# EAGLE design humidity and temprature sensor (EAGLE 6.1)
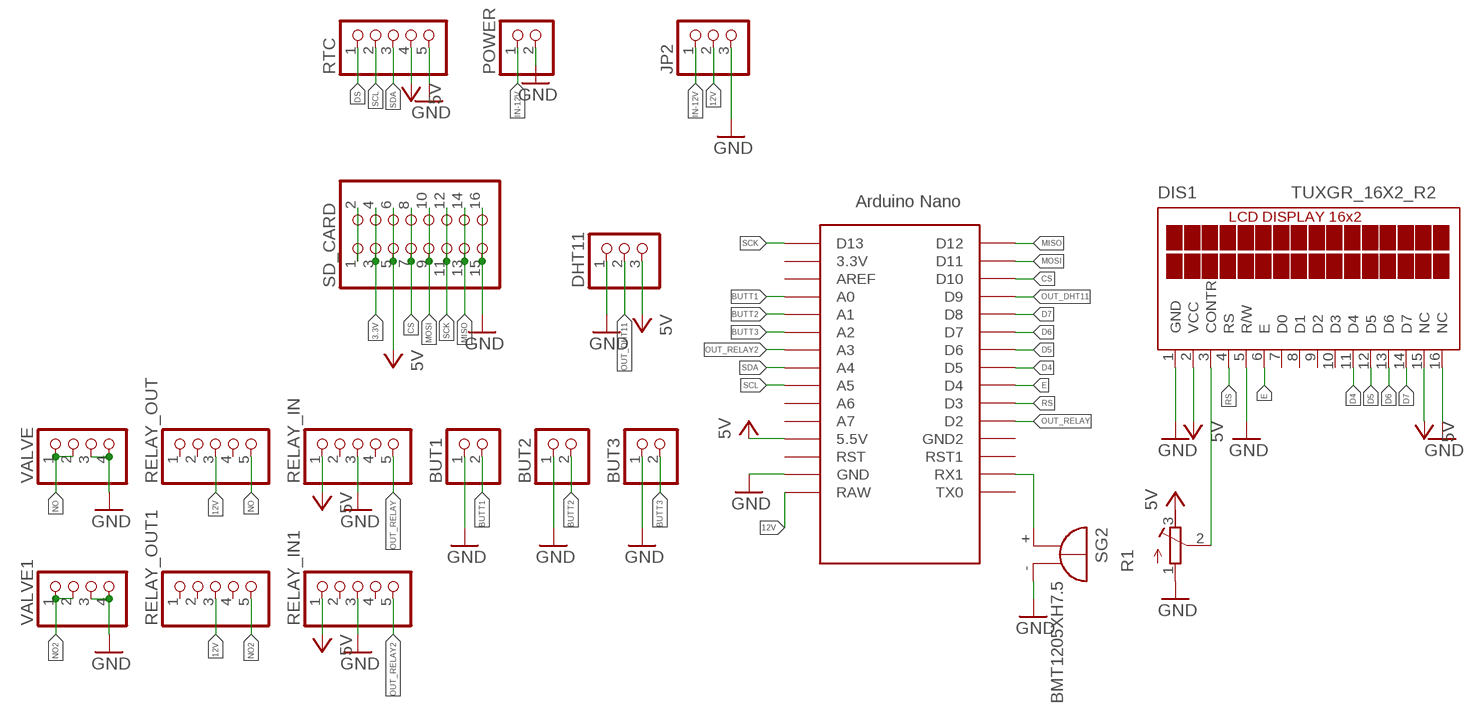
[diagram p0: schematic, sheet 1]

## Parts
BUT1  PINHD-1X2  [1X02]
BUT2  PINHD-1X2  [1X02]
BUT3  PINHD-1X2  [1X02]
DHT11  PINHD-1X3  [1X03]
DIS1  TUXGR_16X2_R2  [TUXGR_16X2_R2]
JP2  PINHD-1X3  [1X03]
POWER  PINHD-1X2  [1X02]
R1  R-TRIMM3339P  [RTRIM3339P]
RELAY_IN  PINHD-1X5  [1X05]
RELAY_IN1  PINHD-1X5  [1X05]
RELAY_OUT  PINHD-1X5  [1X05]
RELAY_OUT1  PINHD-1X5  [1X05]
RTC  PINHD-1X5  [1X05]
SD_CARD  PINHD-2X8  [2X08]
SG2  BMT1205XH7.5  [BMT1205XH7.5]
U$2  NANO  [NANO]
VALVE  PINHD-1X4  [1X04]
VALVE1  PINHD-1X4  [1X04]

## Nets
3.3V: SD_CARD.3 SD_CARD.4
12V: JP2.2 RELAY_OUT1.3 RELAY_OUT.3 U$2.RAW
BUTT1: BUT1.2 U$2.A0
BUTT2: BUT2.2 U$2.A1
BUTT3: BUT3.2 U$2.A2
CS: SD_CARD.7 SD_CARD.8 U$2.D10
D4: DIS1.11(D4) U$2.D5
D5: DIS1.12(D5) U$2.D6
D6: DIS1.13(D6) U$2.D7
D7: DIS1.14(D7) U$2.D8
DS: RTC.1
E: DIS1.6(E) U$2.D4
GND: BUT1.1 BUT2.1 BUT3.1 DHT11.1 DIS1.1(GND) DIS1.5(R/W) DIS1.16(NC) JP2.3 POWER.2 R1.1(E) RELAY_IN1.3 RELAY_IN.3 RTC.5 SD_CARD.15 SD_CARD.16 SG2.- U$2.GND VALVE1.3 VALVE1.4 VALVE.3 VALVE.4
IN-12V: JP2.1 POWER.1
MISO: SD_CARD.13 SD_CARD.14 U$2.D12
MOSI: SD_CARD.9 SD_CARD.10 U$2.D11
N$2: SD_CARD.1 SD_CARD.2
N$5: DIS1.3(CONTR) R1.2(S)
N$6: SG2.+ U$2.RX1
NO: RELAY_OUT.5 VALVE.1 VALVE.2
NO2: RELAY_OUT1.5 VALVE1.1 VALVE1.2
OUT_DHT11: DHT11.2 U$2.D9
OUT_RELAY: RELAY_IN.5 U$2.D2
OUT_RELAY2: RELAY_IN1.5 U$2.A3
RS: DIS1.4(RS) U$2.D3
SCK: SD_CARD.11 SD_CARD.12 U$2.D13
SCL: RTC.2 U$2.A5
SDA: RTC.3 U$2.A4
VCC: DHT11.3 DIS1.2(VCC) DIS1.15(NC) R1.3(A) RELAY_IN1.1 RELAY_IN.1 RTC.4 SD_CARD.5 SD_CARD.6 U$2.5V(5.5V) ; supply symbol labelled 5V
Unconnected: DIS1.7(D0) DIS1.8(D1) DIS1.9(D2) DIS1.10(D3) RELAY_IN1.2 RELAY_IN1.4 RELAY_IN.2 RELAY_IN.4 RELAY_OUT1.1 RELAY_OUT1.2 RELAY_OUT1.4 RELAY_OUT.1 RELAY_OUT.2 RELAY_OUT.4 U$2.3.3V U$2.A6 U$2.A7 U$2.AREF U$2.GND1(GND2) U$2.RST U$2.RST1 U$2.TX0

## Library data of the parts
BUT1-BUT3 POWER = pinhead:PINHD-1X2: PIN HEADER
DHT11 JP2 = pinhead:PINHD-1X3: PIN HEADER
DIS1 = display-lcd:TUXGR_16X2_R2: Tuxgraphics LCD display 16x2 characters reflective, without background light Source: tuxgr_12x2_r2.pdf; OC_FARNELL: unknown; OC_NEWARK: unknown
R1 = resistor:R-TRIMM: Trimm resistor
RELAY_IN RELAY_IN1 RELAY_OUT RELAY_OUT1 RTC = pinhead:PINHD-1X5: PIN HEADER
SD_CARD = pinhead:PINHD-2X8: PIN HEADER
SG2 = buzzer:BMT1205XH7.5: MAGNETIC TRANSDUCER Source: Http:www.be-star.com; OC_FARNELL: unknown; OC_NEWARK: unknown
U$2 = Arduino-clone:NANO: Arduino Nano
VALVE VALVE1 = pinhead:PINHD-1X4: PIN HEADER

## Board
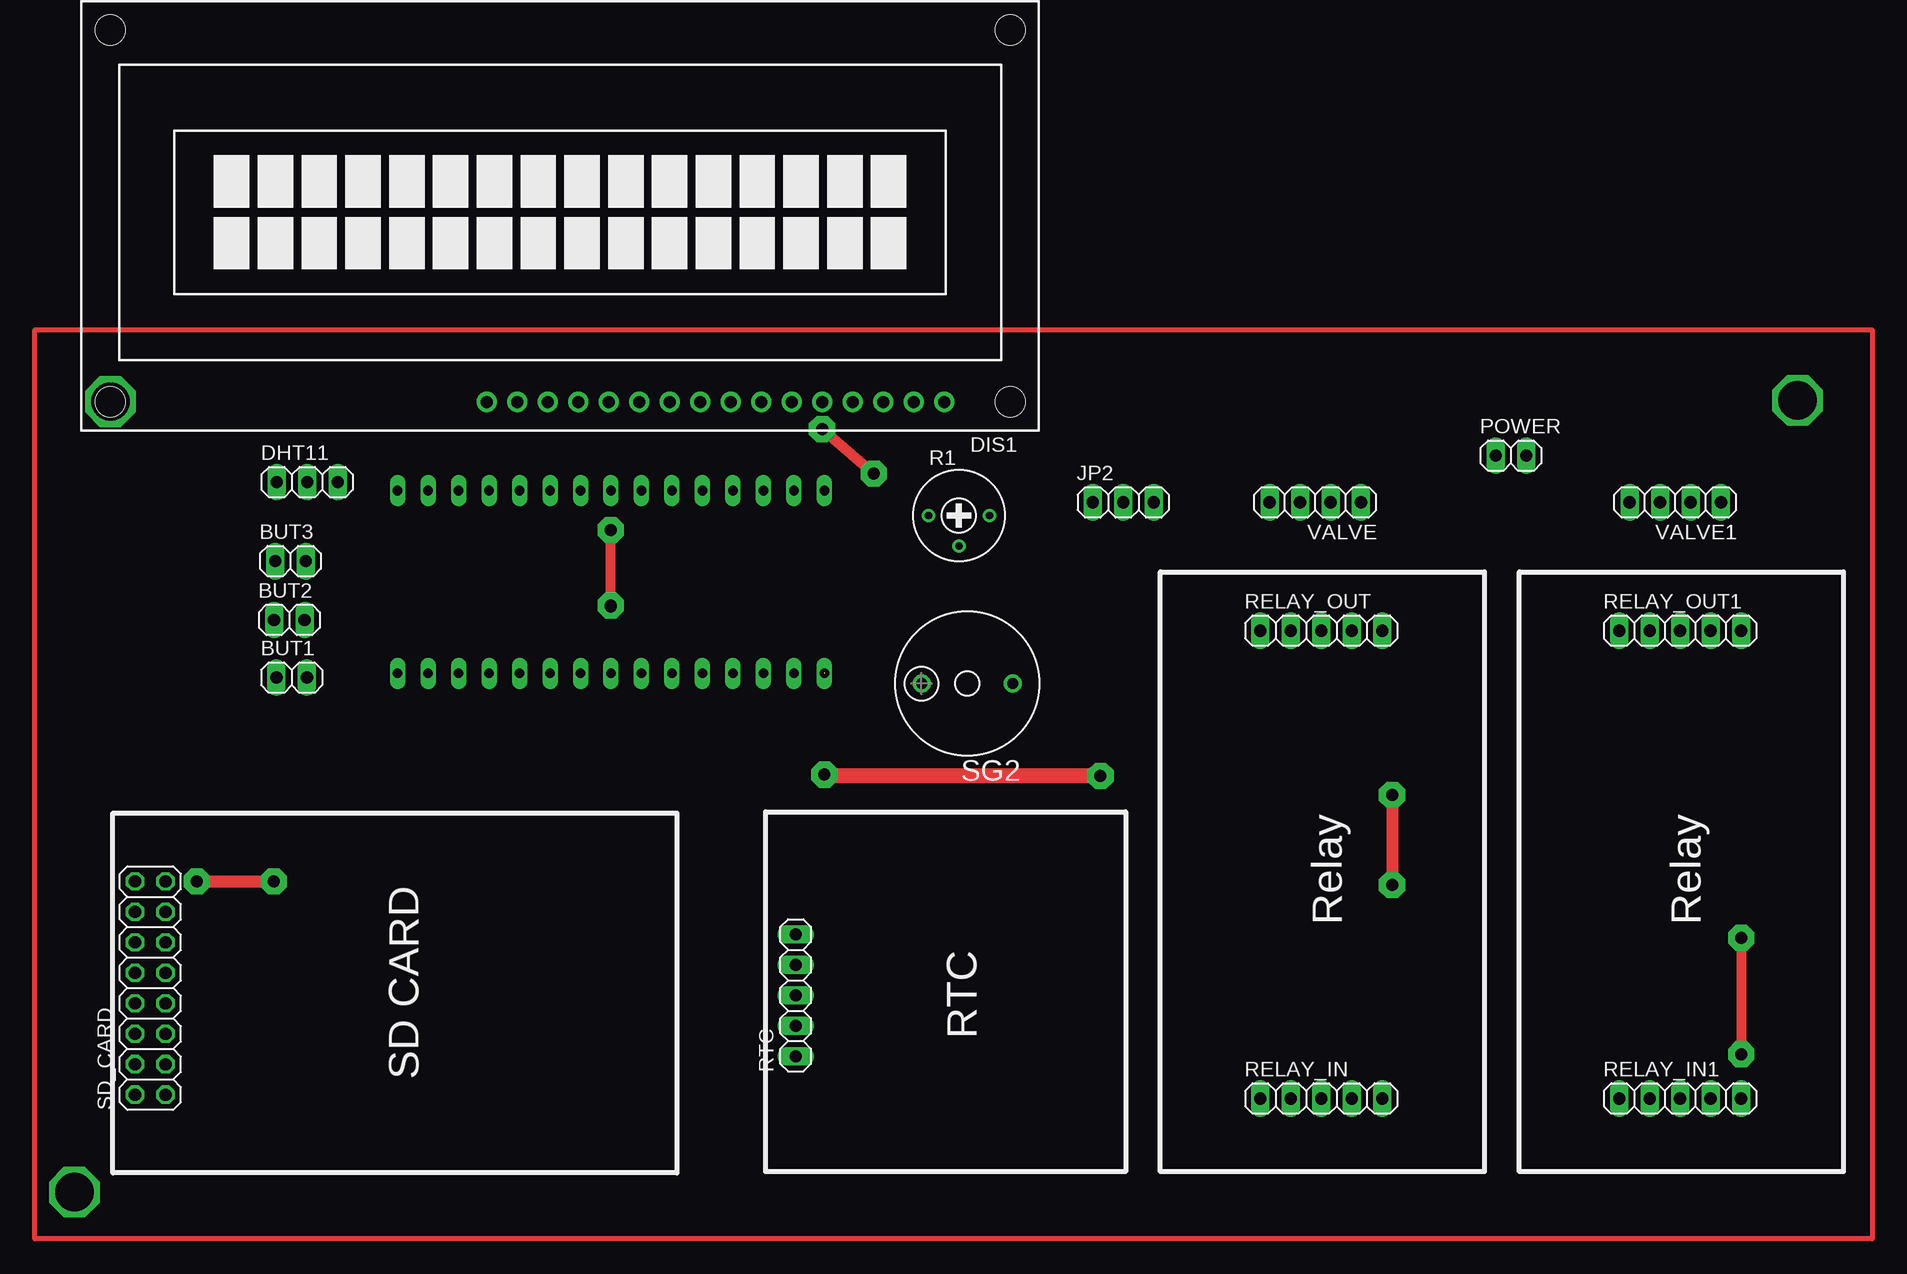
[diagram p1: board, top side]
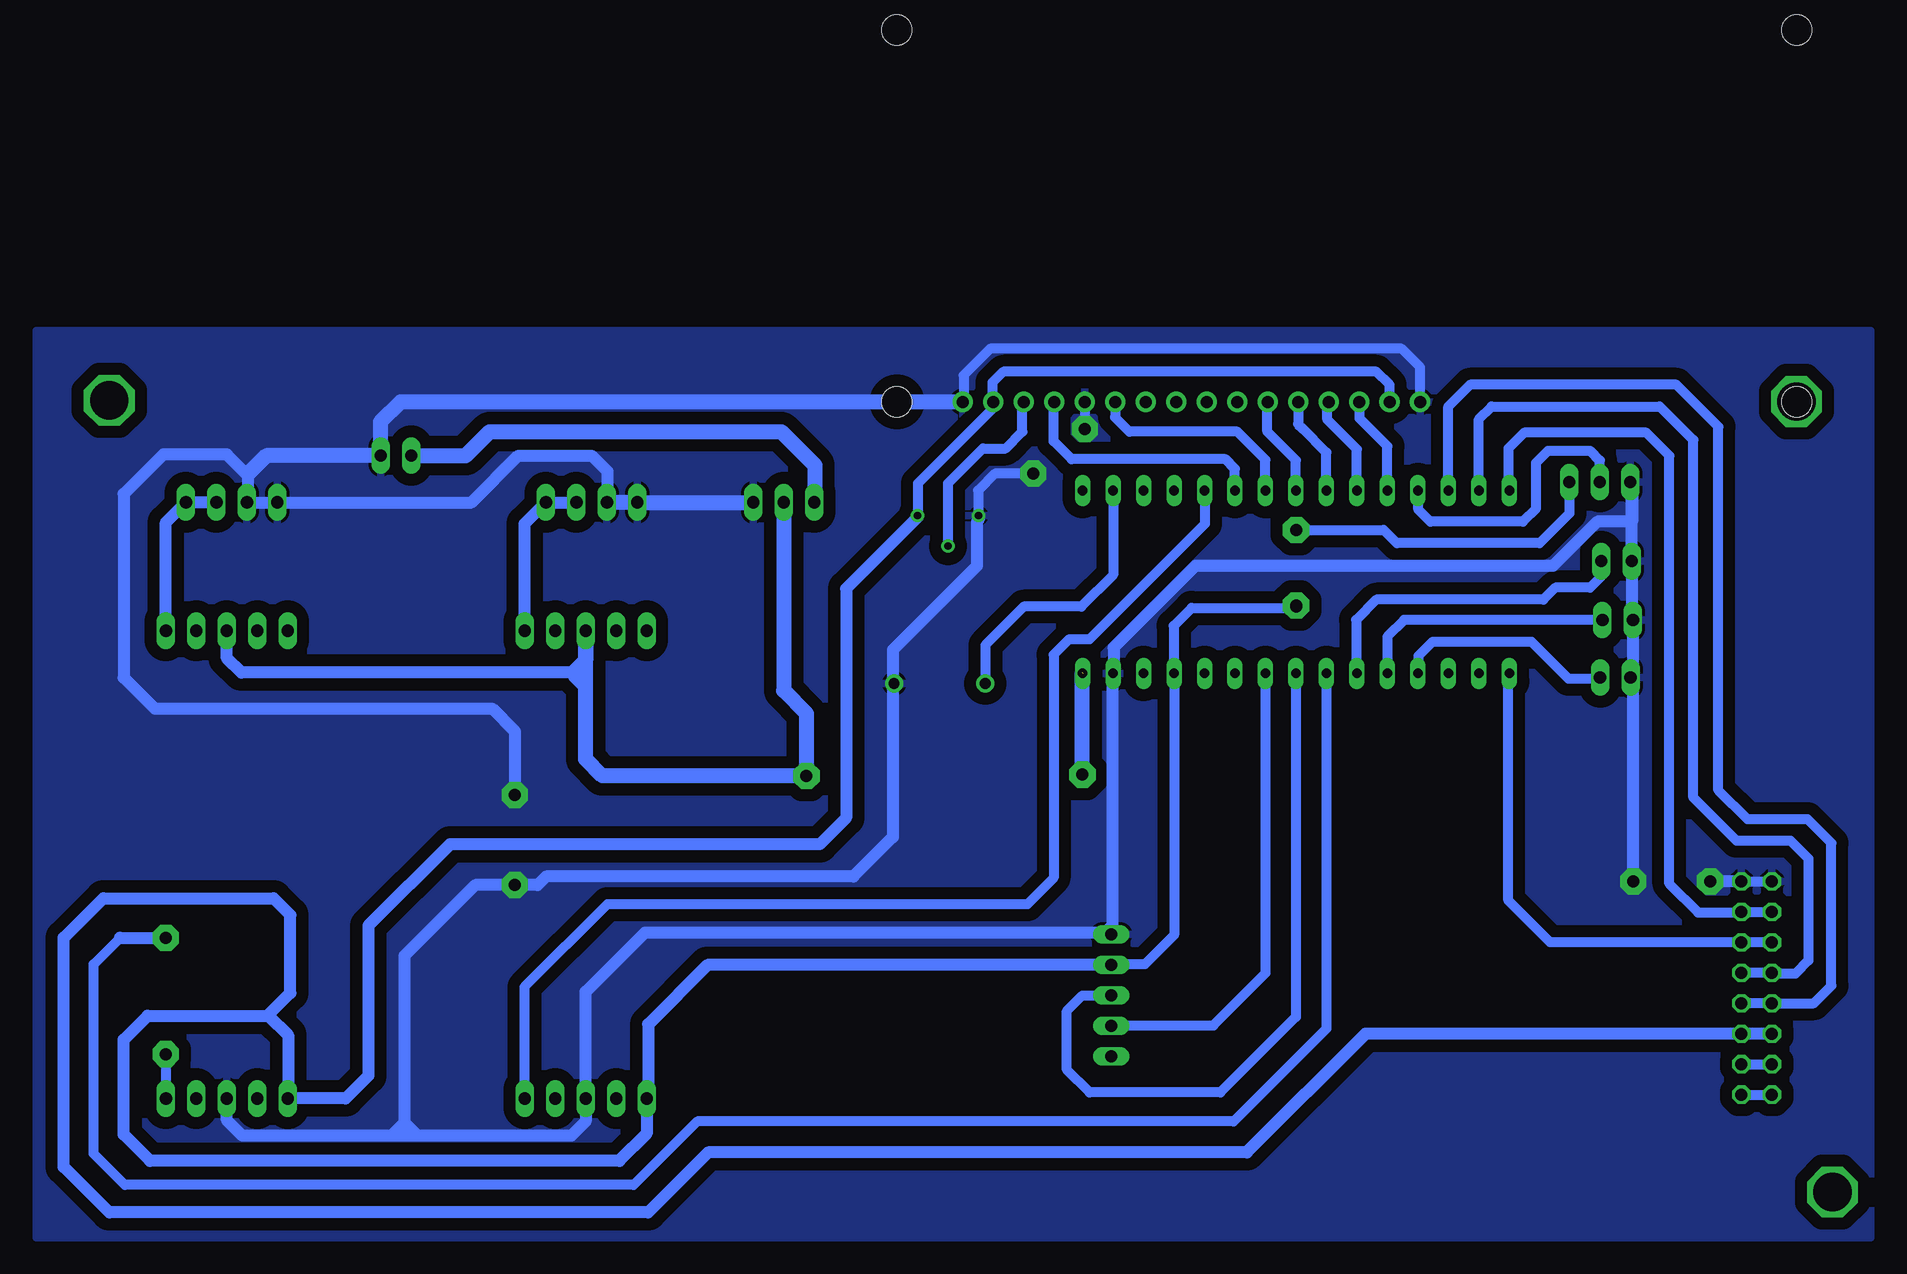
[diagram p2: board, bottom side, seen from below]

No outline drawn. Coordinates in mm, seen from the top.
Copper layers (1*16): Top 0.035mm / dielectric 1.5mm / Bottom 0.035mm
Design rules: minimum track width 10mil, minimum drill 24mil, track to track 8mil, track to pad 8mil, pad to pad 8mil, via to via 8mil, smd to smd 8mil, copper to edge 40mil, drill to drill 8mil, minimum pad ring 10mil, minimum via ring 8mil, stop-mask expansion 4mil, vias tented up to drill 0mil, thermal gap 10mil

### Footprints (pad centres in the part's own frame; a part is rotated, then mirrored left to right if it is on the bottom)
1X02 = drill 1.016 long: 1 -1.27,0; 2 1.27,0
1X03 = drill 1.016 long: 1 -2.54,0; 2 0,0; 3 2.54,0
TUXGR_16X2_R2 = drill 1 pad 1.676: 1 -32,15.5; 2 -29.46,15.5; 3 -26.92,15.5; 4 -24.38,15.5; 5 -21.84,15.5; 6 -19.3,15.5; 7 -16.76,15.5; 8 -14.22,15.5; 9 -11.68,15.5; 10 -9.14,15.5; 11 -6.6,15.5; 12 -4.06,15.5; 13 -1.52,15.5; 14 1.02,15.5; 15 3.56,15.5; 16 6.1,15.5 | hole 2.5: -37.5,-15.5; 37.5,-15.5; -37.5,15.5; 37.5,15.5
RTRIM3339P = drill 0.61: 1 -2.54,0; 2 0,-2.54; 3 2.54,0
1X05 = drill 1.016 long: 1 -5.08,0; 2 -2.54,0; 3 0,0; 4 2.54,0; 5 5.08,0
2X08 = drill 1.016 octagon: 1 -8.89,-1.27; 2 -8.89,1.27; 3 -6.35,-1.27; 4 -6.35,1.27; 5 -3.81,-1.27; 6 -3.81,1.27; 7 -1.27,-1.27; 8 -1.27,1.27; 9 1.27,-1.27; 10 1.27,1.27; 11 3.81,-1.27; 12 3.81,1.27; 13 6.35,-1.27; 14 6.35,1.27; 15 8.89,-1.27; 16 8.89,1.27
BMT1205XH7.5 = drill 0.9 pad 1.5: + 3.8,0; - -3.8,0
NANO = drill 0.8 long: 3.3V -10.16,24.13; 5V -10.16,-1.27; A0 -10.16,19.05; A1 -10.16,16.51; A2 -10.16,13.97; A3 -10.16,11.43; A4 -10.16,8.89; A5 -10.16,6.35; A6 -10.16,3.81; A7 -10.16,1.27; AREF -10.16,21.59; D2 5.08,1.27; D3 5.08,3.81; D4 5.08,6.35; D5 5.08,8.89; D6 5.08,11.43; D7 5.08,13.97; D8 5.08,16.51; D9 5.08,19.05; D10 5.08,21.59; D11 5.08,24.13; D12 5.08,26.67; D13 -10.16,26.67; GND -10.16,-6.35; GND1 5.08,-1.27; RAW -10.16,-8.89; RST -10.16,-3.81; RST1 5.08,-3.81; RX1 5.08,-6.35; TX0 5.08,-8.89
1X04 = drill 1.016 long: 1 -3.81,0; 2 -1.27,0; 3 1.27,0; 4 3.81,0

### Placement (x,y rotation side)
BUT1  -41.1,-9.9 0 top
BUT2  -41.3,-5.1 0 top
BUT3  -41.2,-0.2 0 top
DHT11  -39.81,6.39 0 top
DIS1  -18.73,28.58 180 top
JP2  28.2,4.7 0 top
POWER  60.5,8.6 0 top
R1  14.5,3.6 0 top
RELAY_IN  44.7,-45 0 top
RELAY_IN1  74.6,-45 0 top
RELAY_OUT  44.7,-6 0 top
RELAY_OUT1  74.6,-6 0 top
RTC  0.9,-36.4 90 top
SD_CARD  -52.88,-35.79 90 top
SG2  15.2,-10.4 180 top
U$2  -5.6,0.6 90 top
VALVE  44.2,4.7 180 top
VALVE1  74.2,4.7 180 top

### Tracks (layer width: path | path; a pad name or v marks a point on that pad's centre or on a via)
3.3V
  Bottom 0.813: SD_CARD.3 SD_CARD.4
12V  (via drill 0.6, 1 pad 2.18)  (1 unrouted)
  Top 1.27: v26.3,-18.1 3.4,-18.1 v3.3,-18
  Bottom 1.016: 45.7,-9.5 73.4,-9.5 74.6,-8.3 RELAY_OUT1.3
  Bottom 1.27: 26.23,-18.03 v26.3,-18.1 | v3.3,-18 3.3,-9.5 | v26.3,-18.1 43.3,-18.1 44.7,-16.7 44.7,-10.6 | 44.7,-10.6 RELAY_OUT.3 44.7,-8.5 45.7,-9.5 | 44.7,-10.6 45.6,-9.7 | JP2.2 28.2,-11 26.3,-12.9 v26.3,-18.1
BUTT1
  Bottom 0.813: U$2.A0 -24.7,-9.51 -24.7,-8.1 -25.9,-6.9 -34.1,-6.9 -37.2,-10 -39.73,-10 BUT1.2
BUTT2
  Bottom 0.813: BUT2.2 -23.5,-5.1 -22.1,-6.5 U$2.A1
BUTT3
  Bottom 0.813: BUT3.2 -39.93,-1.47 -39,-2.4 -36.1,-2.4 -35.1,-3.4 -21.2,-3.4 -19.5,-5.1 -19.5,-9.49 U$2.A2
CS
  Bottom 0.813: SD_CARD.7 SD_CARD.8 -57.64,-37.06 -59.1,-35.6 -59.1,-23.7 -57.1,-21.7 -52.1,-21.7 -49.7,-19.3 -49.7,11 -46.2,14.5 -29,14.5 -27.2,12.7 U$2.D10
D4
  Bottom 0.813: U$2.D5 -14.49,8.21 -12.1,10.6 -12.1,13.05 DIS1.11
D5
  Bottom 0.813: U$2.D6 -17.03,8.87 -15.05,10.85 -14.7,11.2 -14.67,11.23 DIS1.12
D6
  Bottom 0.813: U$2.D7 -19.57,9.13 -17.1,11.6 -17.1,12.97 DIS1.13
D7
  Bottom 0.813: U$2.D8 -22.11,9.39 -19.8,11.7 -19.8,13.03 DIS1.14
E
  Bottom 0.813: U$2.D4 -11.95,8.25 -9.6,10.6 -0.6,10.6 0.6,11.8 0.57,11.83 DIS1.6
GND  (via drill 0.6, 1, 1 pad 2.18)
  Top 0.813: v3.1,10.8 v7.4,7.1
  Top 1.016: v-49,-26.9 v-42.6,-26.9 | v50.6,-19.7 v50.6,-27.2
  Bottom 0.813: SD_CARD.15 SD_CARD.16 | DIS1.16 -24.83,15.97 -23.3,17.5 11,17.5 13.2,15.3 13.2,13.15 DIS1.1 | DIS1.5 v3.11,10.81 v3.1,10.8 | v7.4,7.1 10.6,7.1 12,5.7 12,3.64 R1.1 | U$2.GND 0.7,-9.5 | SG2.- 19,-7.6 19.1,-7.5 19.1,-7.6
  Bottom 1.016: RTC.5 0.75,-31.17 1.4,-31.17 | SD_CARD.15 v-49,-26.9 | v-42.6,-26.9 -42.6,-10.83 BUT1.1 -42.57,-10.6 BUT2.1 -42.47,-5 BUT3.1 -42.47,5.57 DHT11.1 -42.5,6.39 -42.5,3.1 -39.6,3.1 -35.9,-0.6 -6.1,-0.6 0.7,-7.4 0.7,-9.5 0.8,-9.6 0.8,-30.57 1.4,-31.17 | VALVE1.3 VALVE1.4 54.2,4.7 50.3,8.6 44.2,8.6 42.9,7.3 42.9,4.73 VALVE.3 | 58.7,-48.1 45.9,-48.1 44.7,-46.9 RELAY_IN.3 44.7,-36.1 39.77,-31.17 1.4,-31.17 | 58.7,-48.1 59.9,-48.1 | 59.9,-48.1 60.9,-48.1 | 60.9,-48.1 73.3,-48.1 74.6,-46.8 RELAY_IN1.3 | R1.1 11.96,3.24 12.1,3.1 12.1,-0.6 19.1,-7.6 19.1,-23.2 22.4,-26.5 48,-26.5 48.7,-27.2 v50.6,-27.2 53.9,-27.2 59.8,-33.1 59.8,-47.2 | 59.8,-47.2 59.8,-48 59.9,-48.1 | 58.7,-48.1 59.6,-47.2 59.8,-47.2 | 59.9,-47.1 60.9,-48.1 | 72.8,4.83 72.8,6.9 74.6,8.7 79.9,8.7 83.2,5.4 83.2,-9.9 80.6,-12.5 52.5,-12.5 50.6,-14.4 v50.6,-19.7
  Bottom 1.27: DIS1.1 60.12,13.08 61.8,11.4 61.8,8.63 POWER.2 71.3,8.6 72.8,7.1 | 72.8,4.83 VALVE1.3 | 42.9,4.73 40.42,4.73 VALVE.4 JP2.3
  pour Bottom (isolate 1.016): -62.4,19 90.5,19 90.5,-56.6 -62.4,-56.6
IN-12V
  Bottom 1.27: POWER.1 54.7,8.6 52.7,10.6 28.4,10.6 25.6,7.8 25.6,4.76 JP2.1
MISO
  Bottom 0.813: SD_CARD.14 SD_CARD.13 -51.55,-29.5 -48,-29.5 -45.6,-27.1 -45.6,8.6 -43.7,10.5 -33.5,10.5 -32.2,9.2 -32.2,5.75 U$2.D12
MOSI
  Bottom 0.813: -51.53,-34.6 SD_CARD.9 SD_CARD.10 -54.23,-34.6 -56.1,-34.6 -57.2,-33.5 -57.2,-25 -55.7,-23.5 -51.2,-23.5 -47.6,-19.9 -47.6,9.9 -44.8,12.7 -30.8,12.7 -29.73,11.63 U$2.D11
N$2
  Bottom 0.813: SD_CARD.1 SD_CARD.2
N$3
  Top 0.406: -62.5,19.1 90.6,19.1 90.6,-56.7 -62.5,-56.7 -62.5,19.1
N$5
  Bottom 0.813: R1.2 14.5,6.3 11.6,9.2 9.7,9.2 8.3,10.6 8.3,12.97 DIS1.3
N$6
  Bottom 0.813: U$2.RX1 0.75,-1.35 3.4,-4 8.2,-4 11.4,-7.2 SG2.+
N$8  (via drill 3.2 pad 2.54)
  other vias: -56.2,13.1
N$10  (via drill 3.2 pad 3.81)
  other vias: 84.4,13.2
N$14  (via drill 3.2 pad 3.81)
  other vias: -59.2,-52.8
NO
  Bottom 1.016: RELAY_OUT.5 49.78,2.93 VALVE.1 VALVE.2
NO2
  Bottom 1.016: VALVE1.2 VALVE1.1 79.68,3.03 RELAY_OUT1.5
OUT_DHT11
  Bottom 0.813: U$2.D9 -24.7,5.63 -24.7,4.1 -25.7,3.1 -33.4,3.1 -34.5,4.2 -34.5,8 -35.5,9 -39,9 -39.81,8.19 DHT11.2
OUT_RELAY
  Bottom 0.813: RELAY_IN.5 49.8,-44.98 49.8,-40.2 49.8,-38.6 49.8,-35.7 42.9,-28.8 7.9,-28.8 5.7,-26.6 5.7,-8 4.4,-6.7 2.7,-6.7 -6.9,2.9 -6.87,2.93 U$2.D2
OUT_RELAY2  (via drill 1, 1 pad 2.18)
  Top 0.813: v79.7,-31.6 v79.7,-41.3
  Bottom 0.813: U$2.A3 -17.03,-39.17 -9.3,-46.9 35.4,-46.9 40.7,-52.2 83.1,-52.2 85.7,-49.6 85.7,-33.8 83.5,-31.6 | v79.7,-41.3 79.7,-44.98 RELAY_IN1.5
  Bottom 1.016: 83.5,-31.6 v79.7,-31.6
RS
  Bottom 0.813: U$2.D3 -9.41,7.49 -8.6,8.3 4.2,8.3 5.7,9.8 5.7,13.03 DIS1.4
SCK
  Bottom 0.813: SD_CARD.12 SD_CARD.11 -35.68,-31.98 -32.2,-28.5 -32.2,-9.63 U$2.D13
SCL
  Bottom 0.813: U$2.A5 -11.95,-34.55 -7.6,-38.9 0.86,-38.9 RTC.2
SDA
  Bottom 0.813: U$2.A4 -14.49,-38.21 -8.2,-44.5 2.7,-44.5 4.6,-42.6 4.6,-37.7 3.3,-36.4 RTC.3
VCC  (via drill 1, 1 pad 2.18)
  Top 0.813: v-14.5,-4 v-14.5,-3.9 v-14.5,2.4
  Bottom 0.813: RTC.4 0.84,-33.8 -1.9,-33.8 -4.33,-31.37 U$2.5V -4.3,-9.53 -4.3,-5.6 -5.8,-4.1 -14.4,-4.1 v-14.5,-4 | DIS1.15 -22.29,14.51 -21.2,15.6 9.9,15.6 10.8,14.7 10.8,13.15 DIS1.2 10.73,12.57 17,6.3 17,3.64 R1.3 | DHT11.3 -37.27,3.77 -34.8,1.3 -22.9,1.3 -21.8,2.4 v-14.5,2.4
  Bottom 1.016: SD_CARD.6 SD_CARD.5 -20.3,-39.6 -10.4,-49.5 34.5,-49.5 39.5,-54.5 84.4,-54.5 88.2,-50.7 88.2,-31.6 84.9,-28.3 70.7,-28.3 69.3,-29.7 69.3,-36.2 71.1,-38 71.1,-38.1 | RTC.4 34.56,-33.86 39.5,-38.8 39.5,-44.88 RELAY_IN.1 39.62,-47.92 41.9,-50.2 81,-50.2 83.2,-48 83.2,-40.1 81.2,-38.1 71.1,-38.1 | 71.1,-38.1 69.5,-39.7 69.5,-44.98 RELAY_IN1.1 64.7,-45 62.8,-43.1 62.8,-30.6 56,-23.8 25.2,-23.8 23,-21.6 23,-2.5 17,3.5 17,3.64

### Text on the board
tPlace: Relay | Relay | RTC | SD CARD
tTest: _ | + | LCD 16X2 | _ | _ | _ | + | DHT11 | + | + | +12V | SWITCH | VALVE | VALVE2 | B1 | B2 | B3 | RTC | SD CARD | RELAY | RELAY2